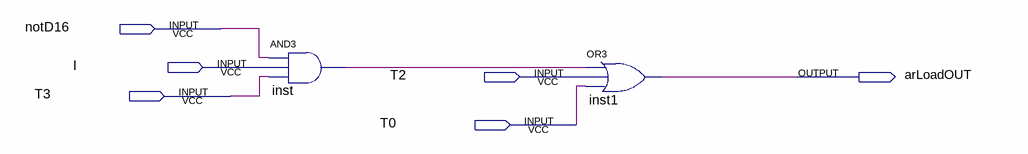
[diagram p0: schematic sheet]
// Quartus schematic arLoad.bdf as structural Verilog: 2 symbols, 6 pins
module arLoad (
  input  notD16,
  input  I,
  input  T2,
  input  T3,
  input  T0,
  output arLoadOUT
);

  wire inst_out;

  and inst (inst_out, notD16, I, T3);
  or inst1 (arLoadOUT, inst_out, T2, T0);
endmodule
